# EAGLE design USBasp_smd06 (EAGLE 4.16)
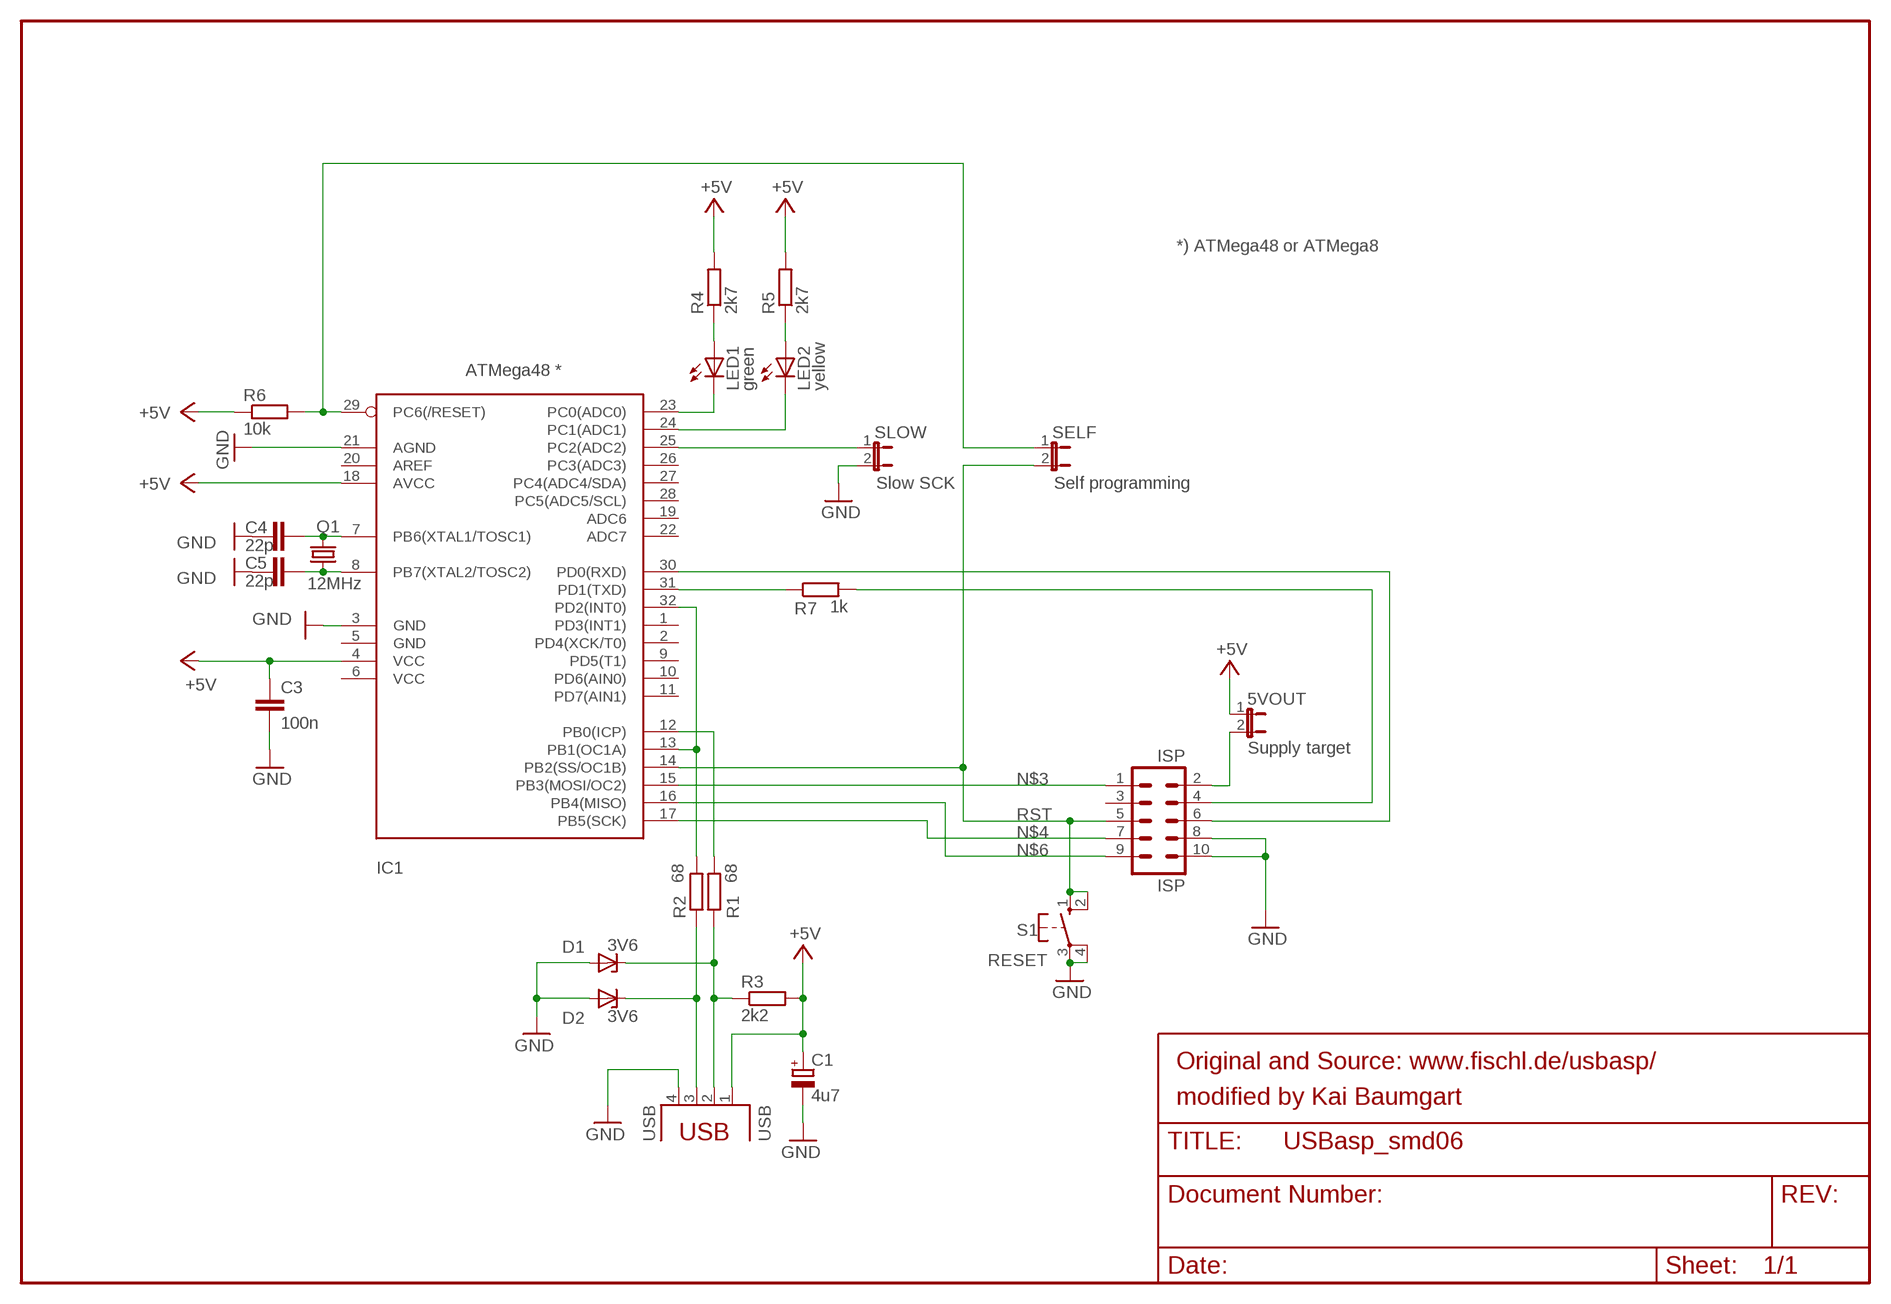
[diagram p0: schematic, sheet 1]

## Parts
5VOUT  Supply target  JP1E  [JP1]
C1  4u7  CPOL-EUE2.5-5  [E2,5-5]
C3  100n  C-EUC0603  [C0603]
C4  22p  C-EUC0603  [C0603]
C5  22p  C-EUC0603  [C0603]
D1  3V6  ZENER-DIODESOT23  [SOT23]
D2  3V6  ZENER-DIODESOT23  [SOT23]
IC1  ATMega48 *  MEGA8-AI  [TQFP32-08]
ISP  ISP  ML10L  [ML10L]
LED1  green  LEDCHIPLED_0805  [CHIPLED_0805]
LED2  yellow  LEDCHIPLED_0805  [CHIPLED_0805]
Q1  12MHz  CRYTALHC49S  [HC49/S]
R1  68  R-EU_R0805  [R0805]
R2  68  R-EU_R0805  [R0805]
R3  2k2  R-EU_R0805  [R0805]
R4  2k7  R-EU_R0805  [R0805]
R5  2k7  R-EU_R0805  [R0805]
R6  10k  R-EU_R0805  [R0805]
R7  1k  R-EU_R0805  [R0805]
S1  RESET  10-XX  [B3F-10XX]
SELF  Self programming  JP1E  [JP1]
SLOW  Slow SCK  JP1E  [JP1]
USB  USB  PN61729  [PN61729]

## Nets
+5V: 5VOUT.1 C1.+ C3.1 IC1.4(VCC) IC1.18(AVCC) R3.2 R4.2 R5.2 R6.1 USB.1
GND: C1.- C3.2 C4.1 C5.2 D1.1(A) D2.1(A) IC1.3(GND) IC1.21(AGND) ISP.8 ISP.10 S1.3(P) S1.4(P1) SLOW.2 USB.4
N$1: IC1.29(PC6(/RESET)) R6.2 SELF.1
N$3: IC1.15(PB3(MOSI/OC2)) ISP.1
N$4: IC1.17(PB5(SCK)) ISP.7
N$5: D1.3(C) R1.1 R3.1 USB.2
N$6: IC1.16(PB4(MISO)) ISP.9
N$7: IC1.13(PB1(OC1A)) IC1.32(PD2(INT0)) R2.2
N$8: D2.3(C) R2.1 USB.3
N$9: IC1.31(PD1(TXD)) R7.1
N$10: ISP.4 R7.2
N$11: IC1.30(PD0(RXD)) ISP.6
N$12: IC1.25(PC2(ADC2)) SLOW.1
N$13: LED1.A R4.1
N$14: IC1.23(PC0(ADC0)) LED1.C
N$15: IC1.24(PC1(ADC1)) LED2.C
N$16: LED2.A R5.1
N$17: 5VOUT.2 ISP.2
N$20: IC1.12(PB0(ICP)) R1.2
N$22: C4.2 IC1.7(PB6(XTAL1/TOSC1)) Q1.2
N$23: C5.1 IC1.8(PB7(XTAL2/TOSC2)) Q1.1
RST: IC1.14(PB2(SS/OC1B)) ISP.5 S1.1(S) S1.2(S1) SELF.2
Unconnected: IC1.1(PD3(INT1)) IC1.2(PD4(XCK/T0)) IC1.5(GND) IC1.6(VCC) IC1.9(PD5(T1)) IC1.10(PD6(AIN0)) IC1.11(PD7(AIN1)) IC1.19(ADC6) IC1.20(AREF) IC1.22(ADC7) IC1.26(PC3(ADC3)) IC1.27(PC4(ADC4/SDA)) IC1.28(PC5(ADC5/SCL)) ISP.3

## Notes on the sheet
- *) ATMega48 or ATMega8
- Original and Source: www.fischl.de/usbasp/
- modified by Kai Baumgart

## Library data of the parts
5VOUT SELF SLOW = jumper:JP1E: JUMPER
C1 = rcl:CPOL-EU: POLARIZED CAPACITOR, European symbol
C3-C5 = rcl:C-EU: CAPACITOR, European symbol
D1 D2 = diode:ZENER-DIODE: Z-Diode
IC1 = atmel:MEGA8: MICROCONTROLLER 8 Kbytes FLASH 1 kbytes SRAM 512 bytes EEPROM USART 6-channel 10 bit ADC 2-channel 8 bit ADC Source: avr.lbr
ISP = con-harting-ml:ML10: HARTING
LED1 LED2 = led:LED: LED OSRAM: - CHIPLED LG R971, LG N971, LY N971, LG Q971, LY Q971, LO R971, LY R971 LH N974, LH R974 LS Q976, LO Q976, LY Q976 LO Q996 - Hyper CHIPLED LW Q18S LB Q993, LB Q99A, LB R99A - SideLED LS A670, LO A670, LY A670, LG A670, LP A670 LB A673, LV A673, LT A673, LW A673 LH A674 LY A675 LS A676, LA A676, LO A676, LY A676, LW A676 LS A679, LY A679, LG A679 - Hyper Micro SIDELED® LS Y876, LA Y876, LO Y876, LY Y876 LT Y87S - SmartLED LW L88C, LW L88S LB L89C, LB L89S, LG L890 LS L89K, LO L89K, LY L89K LS L896, LA L896, LO L896, LY L896 - TOPLED LS T670, LO T670, LY T670, LG T670, LP T670 LSG T670, LSP T670, LSY T670, LOP T670, LYG T670 LG T671, LOG T671, LSG T671 LB T673, LV T673, LT T673, LW T673 LH T674 LS T676, LA T676, LO T676, LY T676, LB T676, LH T676, LSB T676, LW T676 LB T67C, LV T67C, LT T67C, LS T67K, LO T67K, LY T67K, LW E67C LS E67B, LA E67B, LO E67B, LY E67B, LB E67C, LV E67C, LT E67C LW T67C LS T679, LY T679, LG T679 LS T770, LO T770, LY T770, LG T770, LP T770 LB T773, LV T773, LT T773, LW T773 LH T774 LS E675, LA E675, LY E675, LS T675 LS T776, LA T776, LO T776, LY T776, LB T776 LHGB T686 LT T68C, LB T68C - Hyper Mini TOPLED® LB M676 - Mini TOPLED Santana® LG M470 LS M47K, LO M47K, LY M47K Source: http://www.osram.convergy.de/
Q1 = crystal:CRYTAL: CRYSTAL
R1-R7 = rcl:R-EU_: RESISTOR, European symbol
S1 = switch-omron:10-XX: OMRON SWITCH
USB = con-berg:PN61729: BERG USB connector

## Board
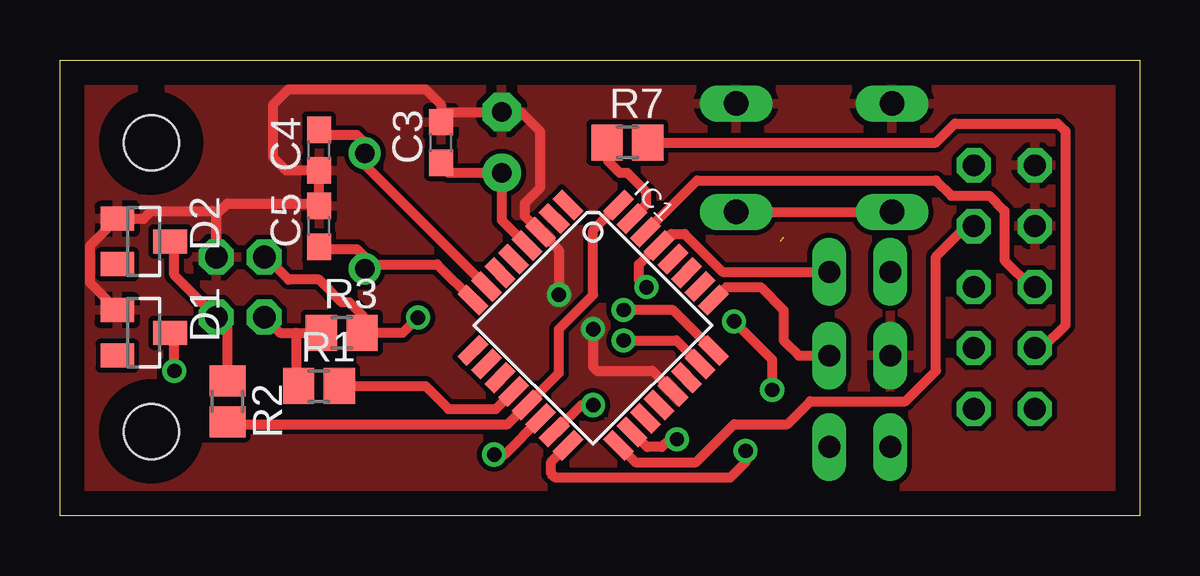
[diagram p1: board, top side]
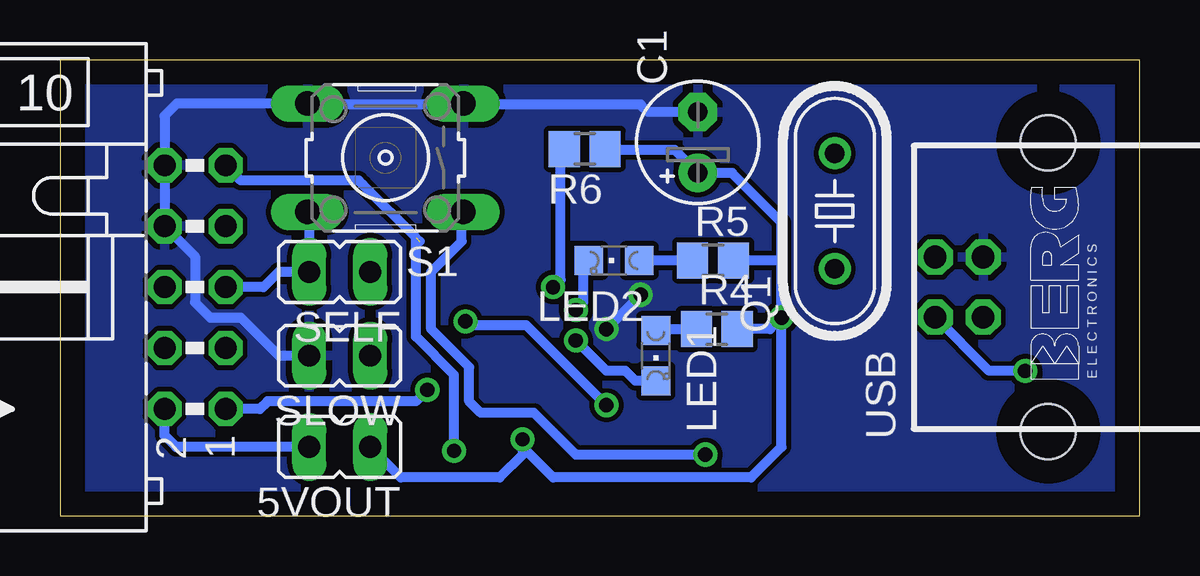
[diagram p2: board, bottom side, seen from below]

Size 45 x 19 mm. Coordinates in mm from the lower left corner, seen from the top.
Outline: 0,0 0,19 45,19 45,0 0,0
Copper layers (1*16): Top 0.035mm / dielectric 1.5mm / Bottom 0.035mm
Design rules "8mils": minimum track width 8mil, minimum drill 0.6mm, track to track 8mil, track to pad 8mil, pad to pad 8mil, via to via 8mil, smd to smd 8mil, copper to edge 40mil, drill to drill 10mil, minimum pad ring 10mil, minimum via ring 8mil, stop-mask expansion 0mil, vias tented up to drill 0mil, thermal gap 10mil

### Footprints (pad centres in the part's own frame; a part is rotated, then mirrored left to right if it is on the bottom)
JP1 = drill 0.914 long: 1 0,-1.27; 2 0,1.27
E2,5-5 = drill 0.813 pad 1.6 round: + -1.27,0 | drill 0.813 pad 1.6 octagon: - 1.27,0
C0603 = smd 1.1 x 1: 1 -0.85,0; 2 0.85,0
SOT23 = smd 1 x 1.4: 1 -0.95,-1.1; 2 0.95,-1.1; 3 0,1.1
TQFP32-08 = smd 1.27 x 0.559: 1 -4.293,2.8; 2 -4.293,2; 3 -4.293,1.2; 4 -4.293,0.4; 5 -4.293,-0.4; 6 -4.293,-1.2; 7 -4.293,-2; 8 -4.293,-2.8; 17 4.293,-2.8; 18 4.293,-2; 19 4.293,-1.2; 20 4.293,-0.4; 21 4.293,0.4; 22 4.293,1.2; 23 4.293,2; 24 4.293,2.8 | smd 0.559 x 1.27: 9 -2.8,-4.293; 10 -2,-4.293; 11 -1.2,-4.293; 12 -0.4,-4.293; 13 0.4,-4.293; 14 1.2,-4.293; 15 2,-4.293; 16 2.8,-4.293; 25 2.8,4.293; 26 2,4.293; 27 1.2,4.293; 28 0.4,4.293; 29 -0.4,4.293; 30 -1.2,4.293; 31 -2,4.293; 32 -2.8,4.293
ML10L = drill 0.914 octagon: 1 -5.08,-1.27; 2 -5.08,1.27; 3 -2.54,-1.27; 4 -2.54,1.27; 5 0,-1.27; 6 0,1.27; 7 2.54,-1.27; 8 2.54,1.27; 9 5.08,-1.27; 10 5.08,1.27
CHIPLED_0805 = smd 1.2 x 1.2: A 0,-1.05; C 0,1.05
HC49/S = drill 0.813 round: 1 -2.413,0; 2 2.413,0
R0805 = smd 1.3 x 1.5: 1 -0.85,0; 2 0.85,0
B3F-10XX = drill 1.016 long: 1 -3.251,2.261; 2 3.251,2.261; 3 -3.251,-2.261; 4 3.251,-2.261
PN61729 = drill 0.95 octagon: 1 1.25,4.71; 2 -1.25,4.71; 3 -1.25,2.71; 4 1.25,2.71 | hole 2.3: -6.02,0; 6.02,0

### Placement (x,y rotation side)
5VOUT  33.34,2.86 90 bottom
C1  18.41,15.56 90 bottom
C3  15.88,15.56 90 top
C4  10.79,15.24 90 top
C5  10.79,12.06 90 top
D1  3.49,7.62 270 top
D2  3.49,11.43 270 top
IC1  22.23,7.94 315 top
ISP  39.37,9.53 90 bottom
LED1  20.16,6.67 180 bottom
LED2  21.91,10.64 90 bottom
Q1  12.7,12.7 90 bottom
R1  10.79,5.4 0 top
R2  6.99,4.76 270 top
R3  11.75,7.62 0 top
R4  17.62,7.78 0 bottom
R5  17.78,10.64 0 bottom
R6  23.13,15.28 180 bottom
R7  23.65,15.56 0 top
S1  31.43,14.92 180 bottom
SELF  33.34,10.16 90 bottom
SLOW  33.34,6.67 90 bottom
USB  3.81,9.53 90 bottom

### Tracks (layer width: path | path; a pad name or v marks a point on that pad's centre or on a via)
+5V  (via drill 0.6)
  Top 0.406: USB.1 8.59,10.78 9.53,9.84 10.79,9.84 11.75,8.89 12.06,8.89 12.6,8.36 R3.2 14.29,7.62 v14.92,8.26 | C3.1 15.88,14.61 16.19,14.29 C1.+ 18.41,12.31 IC1.4 | IC1.18 24.48,2.86 25.08,2.86 25.4,3.17 v25.72,3.17
  Bottom 0.406: v14.92,8.26 14.92,10.64 | 14.92,10.64 R5.2 | 5VOUT.1 30.8,1.59 26.67,1.59 25.72,2.54 v25.72,3.17 25.72,2.86 24.45,1.59 16.19,1.59 14.92,2.86 v14.92,8.26 | 14.92,10.64 14.92,12.22 16.99,14.29 C1.+ 19.37,15.24 22.24,15.24 R6.1 | R4.2 | v14.92,8.26 15.4,7.78 R4.2
GND  (via drill 0.6)
  Top 0.406: 6.52,12.53 USB.4 6.52,12.55 | 6.52,12.55 6.99,13.02 10.79,13.02 C5.2 C4.1 9.42,14.39 8.89,14.92 8.89,17.14 9.53,17.78 15.24,17.78 15.88,17.14 15.88,16.83 | 6.52,12.55 6.5,12.55 6.35,12.7 3.81,12.7 3.49,12.38 D2.1 1.27,11.26 1.27,9.69 D1.1 | 15.88,16.83 C3.2 | 15.88,16.83 C1.- 19.21,16.83 20,16.03 20,13.65 19.37,13.02 19.37,12.49 IC1.3 20.8,11.06 v20.8,9.21 | v22.23,7.78 22.23,6.19 22.38,6.03 24.7,6.03 IC1.21
  Bottom 0.406: SLOW.2 35.88,6.67 37.47,8.26 38.73,8.26 39.37,8.89 39.37,10.79 ISP.8 ISP.10 40.64,16.67 40.13,17.18 S1.4 34.65,17.14 28.22,17.14 S1.3 28.14,17.14 20.8,17.14 20.48,16.83 C1.- | v20.8,9.21 v22.23,7.78
  pour Top: 0,0 0,19 45,19 45,0
  pour Bottom: 0,0 0,19 45,19 45,0
N$1  (via drill 0.6)
  Top 0.406: v24.45,9.53 24.13,9.84 24.13,10.48 24.91,11.26 IC1.29 25.47,11.75 26.04,11.75 27.62,10.16 SELF.1
  Bottom 0.406: R6.2 24.13,15.13 24.13,9.84 v24.45,9.53
N$3  (via drill 0.6)
  Top 0.406: IC1.15 21.72,4.6 v22.23,4.6 | v28.1,8.1 29.69,6.51 v29.69,5.24
  Bottom 0.406: v22.23,4.6 25.56,7.94 27.94,7.94 v28.1,8.1 | v29.69,5.24 30.16,4.76 36.35,4.76 36.67,4.45 ISP.1
N$4
  Top 0.406: IC1.17 23.98,2.22 26.51,2.22 | ISP.7 37.78,12.06 36.51,10.79 36.51,6.03 35.24,4.76 31.27,4.76 30.32,3.81 28.1,3.81 26.51,2.22 | 26.51,2.22
N$5  (via drill 0.6)
  Top 0.406: USB.2 9.18,7.62 9.84,7.62 | 9.84,7.62 R3.1 | R1.1 9.84,5.5 9.84,7.62 | D1.3 4.76,7.62 v4.76,6.03
  Bottom 0.406: USB.2 6.28,6.03 v4.76,6.03
N$6  (via drill 0.6)  (1 unrouted)
  Top 0.406: IC1.16 20.48,2.23 20.48,1.75 20.64,1.59 27.94,1.59 28.57,2.22 v28.57,2.7
  Bottom 0.406: 32.38,13.81 30.16,11.59 30.16,7.46 28.57,5.87 v28.57,2.7 | 32.38,13.81 | 32.38,13.81 32.54,13.97 37.47,13.97 ISP.9 | 30,11.43
N$7
  Top 0.406: R2.2 7.09,3.81 18.66,3.81 IC1.13 20.8,5.94 20.8,7.78 22.23,9.21 22.23,11.9 IC1.32
N$8
  Top 0.406: 4.45,11.43 D2.3 4.76,11.26 4.76,10.03 USB.3 6.99,7.81 R2.1
N$9
  Top 0.406: IC1.31 24.45,12.99 24.45,13.49 23.65,14.29 23.34,14.29 22.86,14.76 22.86,15.5 R7.1 22.86,15.18
N$10
  Top 0.406: R7.2 36.51,15.56 37.31,16.35 41.59,16.35 41.91,16.03 41.91,7.94 40.96,6.99 ISP.4
N$11
  Top 0.406: IC1.30 26.56,13.97 36.51,13.97 37.15,13.34 38.73,13.34 39.37,12.7 39.37,10.64 40.48,9.53 ISP.6
N$12
  Top 0.406: IC1.25 27.77,9.53 29.21,9.53 30.16,8.57 30.16,7.3 30.8,6.67 SLOW.1
N$13
  Bottom 0.406: R4.1 | LED1.A 20.1,7.78 R4.1
N$14  (via drill 0.6)
  Top 0.406: IC1.23 25.69,7.3 v23.5,7.3
  Bottom 0.406: LED1.C 21.02,5.62 21.43,6.03 22.23,6.03 v23.5,7.3
N$15  (via drill 0.6)
  Top 0.406: IC1.24 25.55,8.57 v23.5,8.57
  Bottom 0.406: LED2.C 23.18,10.26 23.18,8.89 v23.5,8.57
N$16
  Bottom 0.406: 20.95,10.48 LED2.A R5.1
N$17
  Bottom 0.406: ISP.2 40.64,3.33 40.16,2.86 5VOUT.2
N$20
  Top 0.406: IC1.12 18.17,4.45 16.19,4.45 15.24,5.4 R1.2
N$22
  Top 0.406: C4.2 10.79,15.88 12.38,15.88 12.7,15.56 Q1.2 12.7,14.63 IC1.7
N$23
  Top 0.406: 12.7,10.48 12.7,10.79 12.38,11.11 11.11,11.11 11.01,11.21 C5.1 | 12.7,10.48 Q1.1 | IC1.8 15.72,10.48 12.7,10.48
RST  (via drill 0.6)
  Top 0.406: IC1.14 18.52,2.54 v18.1,2.54 | S1.2 34.65,12.66 34.61,12.7 34.57,12.66 S1.1
  Bottom 0.406: 28.26,12.7 28.22,12.66 S1.1 | 34.61,12.7 34.57,12.66 | ISP.5 36.51,9.53 35.88,10.16 SELF.2 34.61,12.7 | 34.61,12.7 34.65,12.66 S1.2 | v18.1,2.54 23.5,2.54 25.24,4.29 27.46,4.29 27.94,4.76 27.94,6.19 29.37,7.62 | S1.1 28.14,12.7 | 29.37,7.62 | 29.37,7.62 29.53,7.78 29.53,10.16 28.26,11.43 28.26,12.59 S1.1